# EAGLE design zero_board (EAGLE 9.6.2)
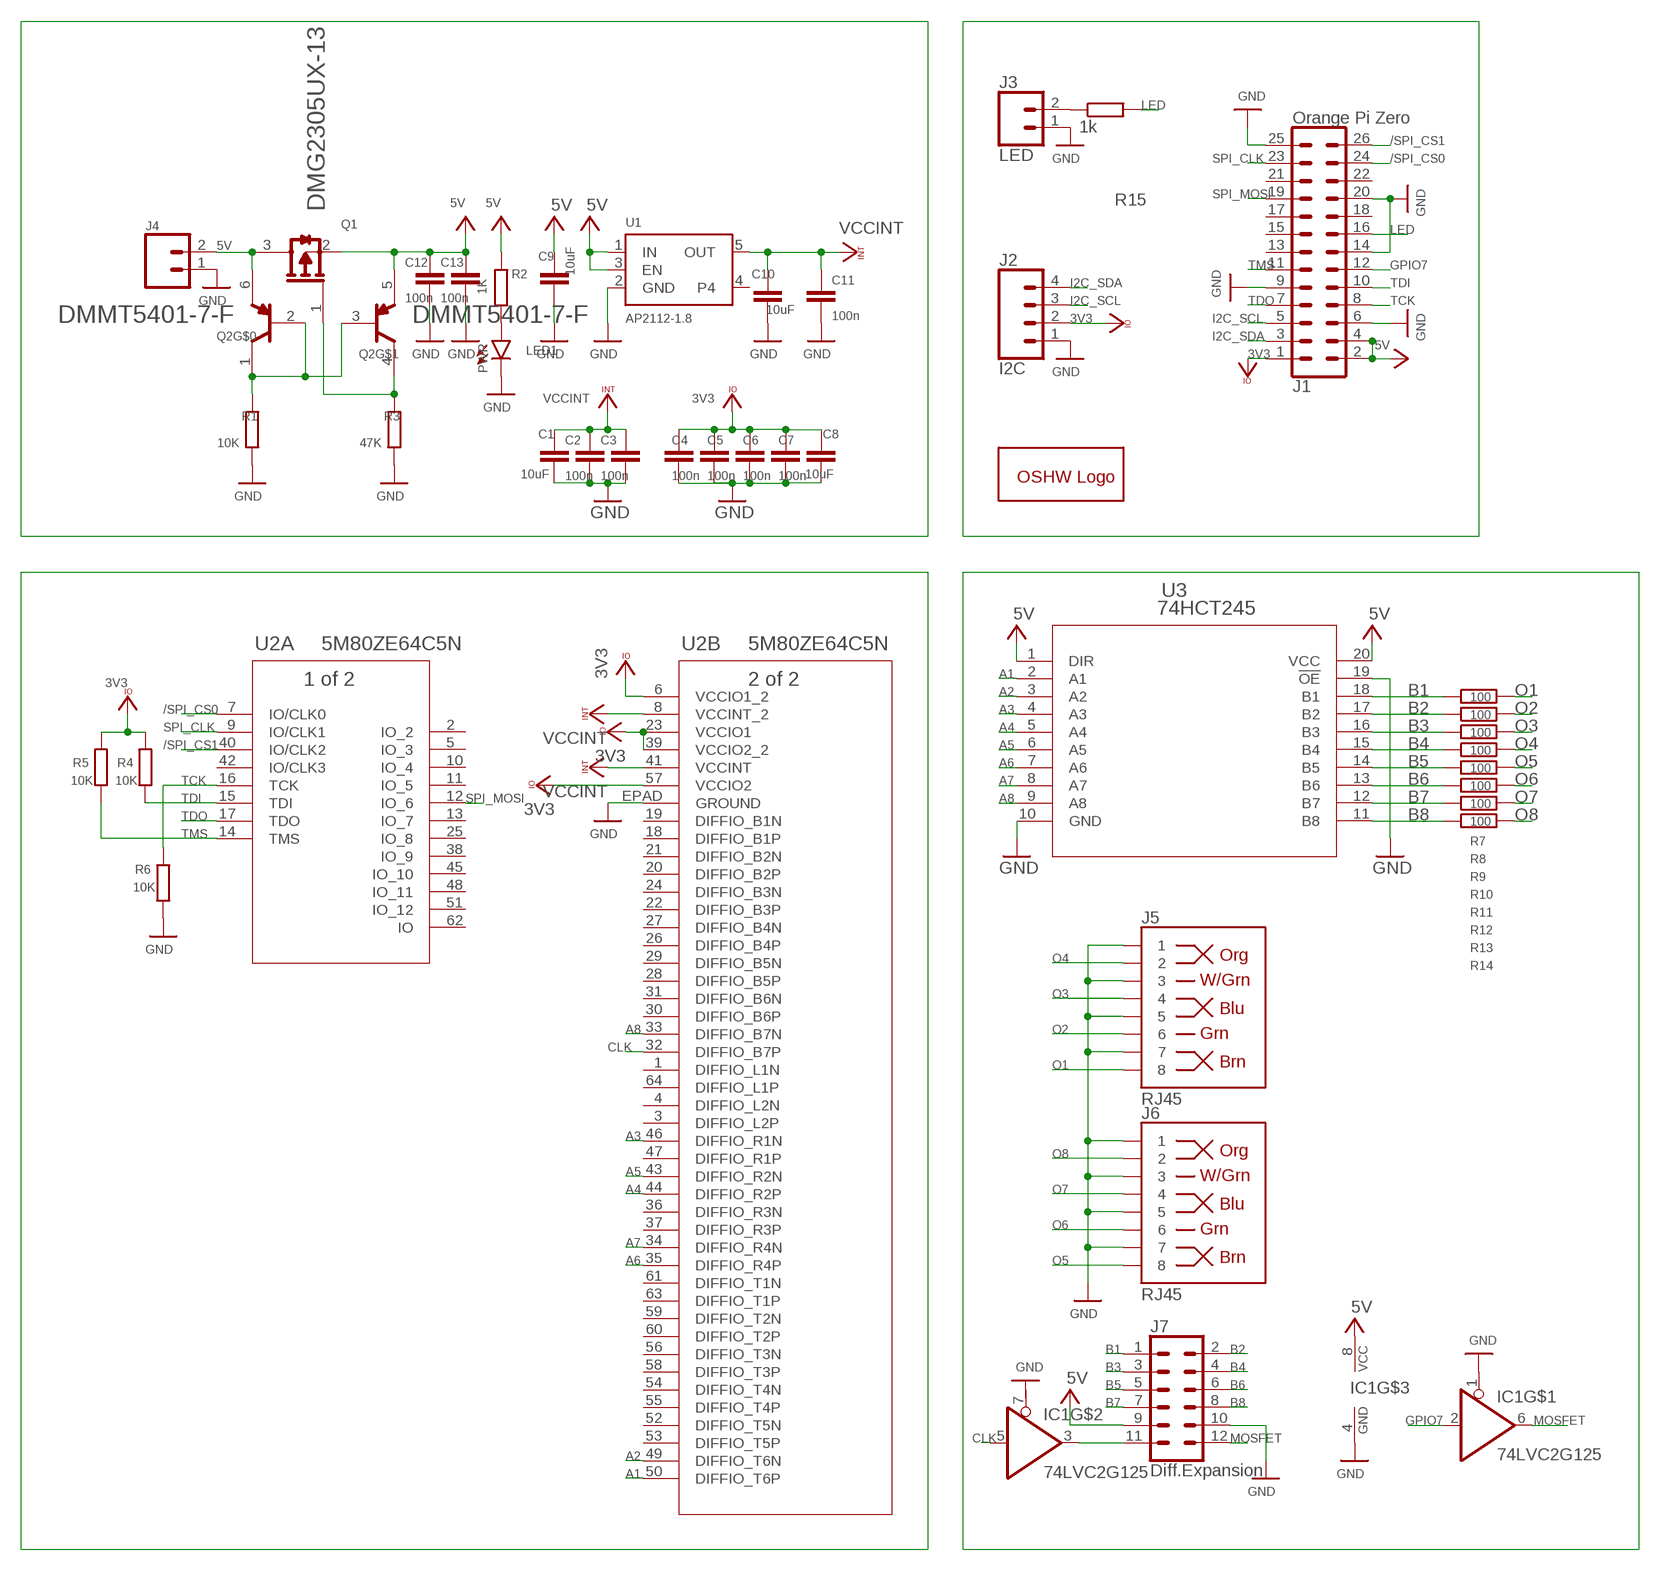
[diagram p0: schematic, sheet 1]

## Parts
C1  10uF  C-EUC0805  [C0805]
C2  100n  C-EUC0603  [C0603]
C3  100n  C-EUC0603  [C0603]
C4  100n  C-EUC0603  [C0603]
C5  100n  C-EUC0603  [C0603]
C6  100n  C-EUC0603  [C0603]
C7  100n  C-EUC0603  [C0603]
C8  10uF  C-EUC0805  [C0805]
C9  10uF  C-EUC0805  [C0805]
C10  10uF  C-EUC0805  [C0805]
C11  100n  C-EUC0603  [C0603]
C12  100n  C-EUC0603  [C0603]
C13  100n  C-EUC0603  [C0603]
GOLD_ORB_SM1  OSHWLOGOLOGO5MM  [OSHW_5MM]
IC1  74LVC2G125  74LVC2G125DCT  [SSOP08]
J1  Orange Pi Zero  CONN_13X22X13  [2X13]
J2  I2C  CONN_04  [1X04]
J3  LED  CONN_02  [1X02]
J4  5V  CONN_023.5MM  [SCREWTERMINAL-3.5MM-2]
J5  RJ45  RJ45-8  [RJ45-8]
J6  RJ45  RJ45-8  [RJ45-8]
J7  Diff.Expansion  CONN_06X2PTH_FEMALE  [2X6]
LED1  PWR  LEDCHIP-LED0603  [CHIP-LED0603]
Q1  DIODES_INC._DMG2305UX-13DIODES_INC._DMG2305UX-13_0_0  [DIODES_INC._DMG2305UX-13_0]
Q2  DMMT5401-7-F_0_0  DIODES_DMMT5401-7-FDIODES_DMMT5401-7-F_0_0  [DIODES_DMMT5401-7-F_0]
R1  10K  R-EU_R0402  [R0402]
R2  1K  R-EU_R0402  [R0402]
R3  47K  R-EU_R0402  [R0402]
R4  10K  R-EU_R0402  [R0402]
R5  10K  R-EU_R0402  [R0402]
R6  10K  R-EU_R0402  [R0402]
R7  100  R-EU_R0402  [R0402]
R8  100  R-EU_R0402  [R0402]
R9  100  R-EU_R0402  [R0402]
R10  100  R-EU_R0402  [R0402]
R11  100  R-EU_R0402  [R0402]
R12  100  R-EU_R0402  [R0402]
R13  100  R-EU_R0402  [R0402]
R14  100  R-EU_R0402  [R0402]
R15  1k  R-EU_R0402  [R0402]
U1  AP2112-1.8  VREG_SOT23-5  [SOT23-5]
U2  5M80ZE64C5N  5M80ZE64C5NEQFP64P_A1P2-D4P5_INT-L  [EQFP64P_A1P2-D4P5_INT-L]
U3  74HCT245  SN74HCT245PWR  [PW20]

## Nets
/SPI_CS0: J1.24 U2.7(A:IO/CLK0)
/SPI_CS1: J1.26 U2.40(A:IO/CLK2)
A1: U2.50(B:DIFFIO_T6P) U3.2(A1)
A2: U2.49(B:DIFFIO_T6N) U3.3(A2)
A3: U2.46(B:DIFFIO_R1N) U3.4(A3)
A4: U2.44(B:DIFFIO_R2P) U3.5(A4)
A5: U2.43(B:DIFFIO_R2N) U3.6(A5)
A6: U2.35(B:DIFFIO_R4P) U3.7(A6)
A7: U2.34(B:DIFFIO_R4N) U3.8(A7)
A8: U2.33(B:DIFFIO_B7N) U3.9(A8)
B1: J7.1 R7.1 U3.18(B1)
B2: J7.2 R8.1 U3.17(B2)
B3: J7.3 R9.1 U3.16(B3)
B4: J7.4 R10.1 U3.15(B4)
B5: J7.5 R11.1 U3.14(B5)
B6: J7.6 R12.1 U3.13(B6)
B7: J7.7 R13.1 U3.12(B7)
B8: J7.8 R14.1 U3.11(B8)
CLK: IC1.5(I) U2.32(B:DIFFIO_B7P)
GND: C1.2 C2.2 C3.2 C4.2 C5.2 C6.2 C7.2 C8.2 C9.2 C10.2 C11.2 C12.2 C13.2 IC1.1(OE) IC1.4(GND) J1.6 J1.9 J1.14 J1.20 J1.25 J2.1 J3.1 J4.1 J5.1 J5.3 J5.5 J5.7 J6.1 J6.3 J6.5 J6.7 J7.10 LED1.C R1.1 R3.1 R6.1 U1.2(GND) U2.EPAD(B:GROUND) U3.10(GND) U3.19(!OE)
GPIO7: IC1.2(I) J1.12
I2C_SCL: J1.5 J2.3
I2C_SDA: J1.3 J2.4
LED: J1.16 R15.2
MOSFET: IC1.6(O) J7.12
N$1: Q2.1(C1) Q2.2(B1) Q2.3(B2) R1.2
N$2: J4.2 Q1.3(D) Q2.6(E1)
N$3: Q1.1(G) Q2.4(C2) R3.2
N$4: J3.2 R15.1
N$9: IC1.3(O) J7.11
N$14: LED1.A R2.2
O1: J5.8 R7.2
O2: J5.6 R8.2
O3: J5.4 R9.2
O4: J5.2 R10.2
O5: J6.8 R11.2
O6: J6.6 R12.2
O7: J6.4 R13.2
O8: J6.2 R14.2
SPI_CLK: J1.23 U2.9(A:IO/CLK1)
SPI_MOSI: J1.19 U2.12(A:IO_6)
TCK: J1.8 R6.2 U2.16(A:TCK)
TDI: J1.10 R4.1 U2.15(A:TDI)
TDO: J1.7 U2.17(A:TDO)
TMS: J1.11 R5.1 U2.14(A:TMS)
VCC: C9.1 C12.1 C13.1 IC1.8(VCC) J1.2 J1.4 J7.9 Q1.2(S) Q2.5(E2) R2.1 U1.1(IN) U1.3(EN) U3.1(DIR) U3.20(VCC) ; supply symbol labelled 5V
VCCINT: C1.1 C2.1 C3.1 C10.1 C11.1 U1.5(OUT) U2.8(B:VCCINT_2) U2.41(B:VCCINT)
VCCIO: C4.1 C5.1 C6.1 C7.1 C8.1 J1.1 J2.2 R4.2 R5.2 U2.6(B:VCCIO1_2) U2.23(B:VCCIO1) U2.39(B:VCCIO2_2) U2.57(B:VCCIO2) ; supply symbol labelled 3V3
Unconnected: IC1.7(OE) J1.13 J1.15 J1.17 J1.18 J1.21 J1.22 U1.4 U2.1(B:DIFFIO_L1N) U2.2(A:IO_2) U2.3(B:DIFFIO_L2P) U2.4(B:DIFFIO_L2N) U2.5(A:IO_3) U2.10(A:IO_4) U2.11(A:IO_5) U2.13(A:IO_7) U2.18(B:DIFFIO_B1P) U2.19(B:DIFFIO_B1N) U2.20(B:DIFFIO_B2P) U2.21(B:DIFFIO_B2N) U2.22(B:DIFFIO_B3P) U2.24(B:DIFFIO_B3N) U2.25(A:IO_8) U2.26(B:DIFFIO_B4P) U2.27(B:DIFFIO_B4N) U2.28(B:DIFFIO_B5P) U2.29(B:DIFFIO_B5N) U2.30(B:DIFFIO_B6P) U2.31(B:DIFFIO_B6N) U2.36(B:DIFFIO_R3N) U2.37(B:DIFFIO_R3P) U2.38(A:IO_9) U2.42(A:IO/CLK3) U2.45(A:IO_10) U2.47(B:DIFFIO_R1P) U2.48(A:IO_11) U2.51(A:IO_12) U2.52(B:DIFFIO_T5N) U2.53(B:DIFFIO_T5P) U2.54(B:DIFFIO_T4N) U2.55(B:DIFFIO_T4P) U2.56(B:DIFFIO_T3N) U2.58(B:DIFFIO_T3P) U2.59(B:DIFFIO_T2N) U2.60(B:DIFFIO_T2P) U2.61(B:DIFFIO_T1N) U2.62(A:IO) U2.63(B:DIFFIO_T1P) U2.64(B:DIFFIO_L1P)

## Library data of the parts
C1-C13 = rcl:C-EU: CAPACITOR, European symbol; SPICEPREFIX: C
GOLD_ORB_SM1 = oshw:OSHWLOGO: The OSHW logo for PCB layout
IC1 = 74xx-little-de:74*2G125: Dual line drivers with 3-state outputs.
J1 = SparkFun-Connectors:CONN_13X2: Multi connection point. Often used as Generic Header-pin footprint for 0.1 inch spaced/style header connections On any of the 0.1 inch spaced packages, you can populate with these: Break Away Headers - Straight <https://www.sparkfun.com/products/116> (PRT-00116) Break Away Male Headers - Right Angle <https://www.sparkfun.com/products/553> (PRT-00553) Female Headers <https://www.sparkfun.com/products/115> (PRT-00115) Break Away Headers - Machine Pin <https://www.sparkfun.com/products/117> (PRT-00117) Break Away Female Headers - Swiss Machine Pin <https://www.sparkfun.com/products/743> (PRT-00743)
J2 = SparkFun-Connectors:CONN_04: Multi connection point. Often used as Generic Header-pin footprint for 0.1 inch spaced/style header connections On any of the 0.1 inch spaced packages, you can populate with these: Break Away Headers - Straight <https://www.sparkfun.com/products/116> (PRT-00116) Break Away Male Headers - Right Angle <https://www.sparkfun.com/products/553> (PRT-00553) Female Headers <https://www.sparkfun.com/products/115> (PRT-00115) Break Away Headers - Machine Pin <https://www.sparkfun.com/products/117> (PRT-00117) Break Away Female Headers - Swiss Machine Pin <https://www.sparkfun.com/products/743> (PRT-00743) For SCREWTERMINALS and SPRING TERMINALS visit here: Screw Terimnals on SparkFun.com <https://www.sparkfun.com/search/results?term=Screw+Terminals> (5mm/3.5mm/2.54mm spacing) This device is also useful as a general connection point to wire up your design to another part of your project. Our various solder wires solder well into these plated through hole pads. Hook-Up Wire - Assortment (Stranded, 22 AWG) <https://www.sparkfun.com/products/11375> (PRT-11375) Hook-Up Wire - Assortment (Solid Core, 22 AWG) <https://www.sparkfun.com/products/11367> (PRT-11367) View the entire wire category on our website here <https://www.sparkfun.com/categories/141> Special notes: Molex polarized connector foot print use with SKU : PRT-08231 with associated crimp pins and housings. 1MM SMD Version SKU: PRT-10208; PROD_ID: CONN-09696
J3 = SparkFun-Connectors:CONN_02: Multi connection point. Often used as Generic Header-pin footprint for 0.1 inch spaced/style header connections On any of the 0.1 inch spaced packages, you can populate with these: Break Away Headers - Straight <https://www.sparkfun.com/products/116> (PRT-00116) Break Away Male Headers - Right Angle <https://www.sparkfun.com/products/553> (PRT-00553) Female Headers <https://www.sparkfun.com/products/115> (PRT-00115) Break Away Headers - Machine Pin <https://www.sparkfun.com/products/117> (PRT-00117) Break Away Female Headers - Swiss Machine Pin <https://www.sparkfun.com/products/743> (PRT-00743) For SCREWTERMINALS and SPRING TERMINALS visit here: Screw Terimnals on SparkFun.com <https://www.sparkfun.com/search/results?term=Screw+Terminals> (5mm/3.5mm/2.54mm spacing) This device is also useful as a general connection point to wire up your design to another part of your project. Our various solder wires solder well into these plated through hole pads. Hook-Up Wire - Assortment (Stranded, 22 AWG) <https://www.sparkfun.com/products/11375> (PRT-11375) Hook-Up Wire - Assortment (Solid Core, 22 AWG) <https://www.sparkfun.com/products/11367> (PRT-11367) View the entire wire category on our website here <https://www.sparkfun.com/categories/141> Special notes: Molex polarized connector foot print use with: PRT-08233 with associated crimp pins and housings. 2.54_SCREWTERM for use with PRT-10571. 3.5mm Screw Terminal footprints for PRT-08084 5mm Screw Terminal footprints for use with PRT-08432
J4 = SparkFun-Connectors:CONN_02: Multi connection point. Often used as Generic Header-pin footprint for 0.1 inch spaced/style header connections On any of the 0.1 inch spaced packages, you can populate with these: Break Away Headers - Straight <https://www.sparkfun.com/products/116> (PRT-00116) Break Away Male Headers - Right Angle <https://www.sparkfun.com/products/553> (PRT-00553) Female Headers <https://www.sparkfun.com/products/115> (PRT-00115) Break Away Headers - Machine Pin <https://www.sparkfun.com/products/117> (PRT-00117) Break Away Female Headers - Swiss Machine Pin <https://www.sparkfun.com/products/743> (PRT-00743) For SCREWTERMINALS and SPRING TERMINALS visit here: Screw Terimnals on SparkFun.com <https://www.sparkfun.com/search/results?term=Screw+Terminals> (5mm/3.5mm/2.54mm spacing) This device is also useful as a general connection point to wire up your design to another part of your project. Our various solder wires solder well into these plated through hole pads. Hook-Up Wire - Assortment (Stranded, 22 AWG) <https://www.sparkfun.com/products/11375> (PRT-11375) Hook-Up Wire - Assortment (Solid Core, 22 AWG) <https://www.sparkfun.com/products/11367> (PRT-11367) View the entire wire category on our website here <https://www.sparkfun.com/categories/141> Special notes: Molex polarized connector foot print use with: PRT-08233 with associated crimp pins and housings. 2.54_SCREWTERM for use with PRT-10571. 3.5mm Screw Terminal footprints for PRT-08084 5mm Screw Terminal footprints for use with PRT-08432; PROD_ID: CONN-08399
J5 J6 = SparkFun-Connectors:RJ45-8: RJ45 Jack - 8 pin Simple RJ45, 8-pin connection. Commonly used for Cat5, Cat5e, and Cat6 Ethernet cables. Here is the connector we sell at SparkFun: RJ45 8-Pin Connector <https://www.sparkfun.com/products/643> (PRT-00643) Datasheet <https://cdn.sparkfun.com/datasheets/Prototyping/04908.pdf> It is used on this SparkFun product: SparkFun RJ45 Breakout <https://www.sparkfun.com/products/716> (BOB-00716) Note, you may also be interested in the "MAGJACK" version of this. It is basically a RJ45 connector, but also has some status LEDs built into the connector housing. You can check that out in this library at the device named "MAGJACK.dev" and see these products online: RJ45 Ethernet MagJack-Compatible <https://www.sparkfun.com/products/8534> (PRT-08534) SparkFun RJ45 MagJack Breakout <https://www.sparkfun.com/products/13021> (BOB-13021); PROD_ID: CONN-08506; SF_ID: PRT-00643
J7 = SparkFun-Connectors:CONN_06X2: Multi connection point. Often used as Generic Header-pin footprint for 0.1 inch spaced/style header connections On any of the 0.1 inch spaced packages, you can populate with these: Break Away Headers - Straight <https://www.sparkfun.com/products/116> (PRT-00116) Break Away Male Headers - Right Angle <https://www.sparkfun.com/products/553> (PRT-00553) Female Headers <https://www.sparkfun.com/products/115> (PRT-00115) Break Away Headers - Machine Pin <https://www.sparkfun.com/products/117> (PRT-00117) Break Away Female Headers - Swiss Machine Pin <https://www.sparkfun.com/products/743> (PRT-00743); PROD_ID: CONN-12423; VALUE: 2X6 FEMALE
LED1 = led:LED: LED OSRAM: - CHIPLED LG R971, LG N971, LY N971, LG Q971, LY Q971, LO R971, LY R971 LH N974, LH R974 LS Q976, LO Q976, LY Q976 LO Q996 - Hyper CHIPLED LW Q18S LB Q993, LB Q99A, LB R99A - SideLED LS A670, LO A670, LY A670, LG A670, LP A670 LB A673, LV A673, LT A673, LW A673 LH A674 LY A675 LS A676, LA A676, LO A676, LY A676, LW A676 LS A679, LY A679, LG A679 - Hyper Micro SIDELED® LS Y876, LA Y876, LO Y876, LY Y876 LT Y87S - SmartLED LW L88C, LW L88S LB L89C, LB L89S, LG L890 LS L89K, LO L89K, LY L89K LS L896, LA L896, LO L896, LY L896 - TOPLED LS T670, LO T670, LY T670, LG T670, LP T670 LSG T670, LSP T670, LSY T670, LOP T670, LYG T670 LG T671, LOG T671, LSG T671 LB T673, LV T673, LT T673, LW T673 LH T674 LS T676, LA T676, LO T676, LY T676, LB T676, LH T676, LSB T676, LW T676 LB T67C, LV T67C, LT T67C, LS T67K, LO T67K, LY T67K, LW E67C LS E67B, LA E67B, LO E67B, LY E67B, LB E67C, LV E67C, LT E67C LW T67C LS T679, LY T679, LG T679 LS T770, LO T770, LY T770, LG T770, LP T770 LB T773, LV T773, LT T773, LW T773 LH T774 LS E675, LA E675, LY E675, LS T675 LS T776, LA T776, LO T776, LY T776, LB T776 LHGB T686 LT T68C, LB T68C - Hyper Mini TOPLED® LB M676 - Mini TOPLED Santana® LG M470 LS M47K, LO M47K, LY M47K Source: http://www.osram.convergy.de LUXEON: - LUMILED® LXK2-PW12-R00, LXK2-PW12-S00, LXK2-PW14-U00, LXK2-PW14-V00 LXK2-PM12-R00, LXK2-PM12-S00, LXK2-PM14-U00 LXK2-PE12-Q00, LXK2-PE12-R00, LXK2-PE12-S00, LXK2-PE14-T00, LXK2-PE14-U00 LXK2-PB12-K00, LXK2-PB12-L00, LXK2-PB12-M00, LXK2-PB14-N00, LXK2-PB14-P00, LXK2-PB14-Q00 LXK2-PR12-L00, LXK2-PR12-M00, LXK2-PR14-Q00, LXK2-PR14-R00 LXK2-PD12-Q00, LXK2-PD12-R00, LXK2-PD12-S00 LXK2-PH12-R00, LXK2-PH12-S00 LXK2-PL12-P00, LXK2-PL12-Q00, LXK2-PL12-R00 Source: www.luxeon.com KINGBRIGHT: KA-3528ASYC Source: www.kingbright.com
Q1 = Diodes Inc. - DMG2305UX-13:DIODES_INC._DMG2305UX-13: P-Channel 20V 4.2A (Ta) 1.4W (Ta) Surface Mount SOT-23; AUTOMOTIVE: No; CENTROID_NOT_SPECIFIED: No; CONTINUOUS_DRAIN_CURRENT: -4.2A; DATASHEET: https://www.diodes.com/assets/Datasheets/DMG2305UX.pdf; DEPLETION_MODE: False; DEVICE_CLASS_L1: Discrete Semiconductors; DEVICE_CLASS_L2: Transistors; DEVICE_CLASS_L3: MOSFETs; DIGIKEY_DESCRIPTION: TRANS MOSFET P-CH 20V 4.2A SOT23; DIGIKEY_PART_NUMBER: DMG2305UX-13DICT-ND; DRAIN_TO_SOURCE_BREAKDOWN_VOLTAGE: -20V; DRAIN_TO_SOURCE_RESISTANCE: 40mΩ; DRAIN_TO_SOURCE_VOLTAGE: -20V; FOOTPRINT_PARAMETERS_1: {"fp_type":"SOT23","params":{"N":{"default":"3","long name":"Number of leads","type":"multichoice","short name":"N"},"A":{"nom":1024999,"long name":"Height","min":903000,"max":1100000,"short name":"A","type":"measurement"},"A1":{"nom":50000,"long name":"Package clearance","min":13000,"max":100000,"short name":"A1","type":"measurement"},"A2":{"nom":975000,"long name":"Package height","min":890000,"max":1000000,"short name":"A2","type":"measurement"},"D":{"nom":2900000,"long name":"Package length","min":2800000,"max":3000000,"short name":"D","type":"measurement"},"E":{"nom":2400000,"long name":"Width /w leads","min":2300000,"max":2500000,"short name":"E","type":"measurement"},"E1":{"nom":1300000,"long name":"Package width","min":1200000,"max":1400000,"short name":"E1","type":"measurement"},"B":{"nom":400000,"long name":"Lead width","min":370000,"max":510000,"short name":"B","type":"measurement"},"C":{"nom":110000,"long name":"Lead thickness","min":85000,"max":150000,"short name":"C","type":"measurement"},"L":{"nom":400000,"long name":"Lead foot length","min":250000,"max":550000,"short name":"L","type":"measurement"},"e":{"nom":915000,"long name":"Lead pitch","min":null,"max":null,"short name":"e","type":"measurement"},"PHI":{"nom":false,"long name":"Lead angle","min":0,"max":8000000,"short name":"PHI","type":"measurement"},"offset x":{"nom":0,"long name":"X Center offset","min":null,"max":null,"short name":"offset x","type":"measurement"},"offset y":{"nom":0,"long name":"Y Center offset","min":null,"max":null,"short name":"offset y","type":"measurement"},"LS":{"default":"Rounded rectangle","long name":"Land shape","type":"multichoice","short name":"LS"},"LS1":{"default":"Rectangle","long name":"Land shape (Pin 1)","type":"multichoice","short name":"LS1"},"solder toe":{"nom":550000,"long name":"Solder fillet (toe)","min":null,"max":null,"short name":"solder toe","type":"fixedmeasurement"},"solder heel":{"nom":450000,"long name":"Solder fillet (heel)","min":null,"max":null,"short name":"solder heel","type":"fixedmeasurement"},"solder side":{"nom":50000,"long name":"Solder fillet (side)","min":null,"max":null,"short name":"solder side","type":"fixedmeasurement"},"courtyard":{"nom":500000,"long name":"Courtyard","min":null,"max":null,"short name":"courtyard","type":"fixedmeasurement"},"SF":{"default":"A","long name":"Packing level","type":"multichoiceparent","short name":"SF","help":"http://support.upverter.com/customer/portal/articles/978783-what-is-a-footprint-packing-level","children":["solder toe","solder heel","solder side","courtyard"]}}}; FOOTPRINT_PARAMETERS_2: {"fp_type":"SOT23","params":{"N":{"default":"3","long name":"Number of leads","type":"multichoice","short name":"N"},"A":{"nom":1024999,"long name":"Height","min":903000,"max":1100000,"short name":"A","type":"measurement"},"A1":{"nom":50000,"long name":"Package clearance","min":13000,"max":100000,"short name":"A1","type":"measurement"},"A2":{"nom":975000,"long name":"Package height","min":890000,"max":1000000,"short name":"A2","type":"measurement"},"D":{"nom":2900000,"long name":"Package length","min":2800000,"max":3000000,"short name":"D","type":"measurement"},"E":{"nom":2400000,"long name":"Width /w leads","min":2300000,"max":2500000,"short name":"E","type":"measurement"},"E1":{"nom":1300000,"long name":"Package width","min":1200000,"max":1400000,"short name":"E1","type":"measurement"},"B":{"nom":400000,"long name":"Lead width","min":370000,"max":510000,"short name":"B","type":"measurement"},"C":{"nom":110000,"long name":"Lead thickness","min":85000,"max":150000,"short name":"C","type":"measurement"},"L":{"nom":400000,"long name":"Lead foot length","min":250000,"max":550000,"short name":"L","type":"measurement"},"e":{"nom":915000,"long name":"Lead pitch","min":null,"max":null,"short name":"e","type":"measurement"},"PHI":{"nom":false,"long name":"Lead angle","min":0,"max":8000000,"short name":"PHI","type":"measurement"},"offset x":{"nom":0,"long name":"X Center offset","min":null,"max":null,"short name":"offset x","type":"measurement"},"offset y":{"nom":0,"long name":"Y Center offset","min":null,"max":null,"short name":"offset y","type":"measurement"},"LS":{"default":"Rounded rectangle","long name":"Land shape","type":"multichoice","short name":"LS"},"LS1":{"default":"Rectangle","long name":"Land shape (Pin 1)","type":"multichoice","short name":"LS1"},"solder toe":{"nom":350000,"long name":"Solder fillet (toe)","min":null,"max":null,"short name":"solder toe","type":"fixedmeasurement"},"solder heel":{"nom":350000,"long name":"Solder fillet (heel)","min":null,"max":null,"short name":"solder heel","type":"fixedmeasurement"},"solder side":{"nom":30000,"long name":"Solder fillet (side)","min":null,"max":null,"short name":"solder side","type":"fixedmeasurement"},"courtyard":{"nom":250000,"long name":"Courtyard","min":null,"max":null,"short name":"courtyard","type":"fixedmeasurement"},"SF":{"default":"B","long name":"Packing level","type":"multichoiceparent","short name":"SF","help":"http://support.upverter.com/customer/portal/articles/978783-what-is-a-footprint-packing-level","children":["solder toe","solder heel","solder side","courtyard"]}}}; FOOTPRINT_PARAMETERS_3: {"fp_type":"SOT23","params":{"N":{"default":"3","long name":"Number of leads","type":"multichoice","short name":"N"},"A":{"nom":1024999,"long name":"Height","min":903000,"max":1100000,"short name":"A","type":"measurement"},"A1":{"nom":50000,"long name":"Package clearance","min":13000,"max":100000,"short name":"A1","type":"measurement"},"A2":{"nom":975000,"long name":"Package height","min":890000,"max":1000000,"short name":"A2","type":"measurement"},"D":{"nom":2900000,"long name":"Package length","min":2800000,"max":3000000,"short name":"D","type":"measurement"},"E":{"nom":2400000,"long name":"Width /w leads","min":2300000,"max":2500000,"short name":"E","type":"measurement"},"E1":{"nom":1300000,"long name":"Package width","min":1200000,"max":1400000,"short name":"E1","type":"measurement"},"B":{"nom":400000,"long name":"Lead width","min":370000,"max":510000,"short name":"B","type":"measurement"},"C":{"nom":110000,"long name":"Lead thickness","min":85000,"max":150000,"short name":"C","type":"measurement"},"L":{"nom":400000,"long name":"Lead foot length","min":250000,"max":550000,"short name":"L","type":"measurement"},"e":{"nom":915000,"long name":"Lead pitch","min":null,"max":null,"short name":"e","type":"measurement"},"PHI":{"nom":false,"long name":"Lead angle","min":0,"max":8000000,"short name":"PHI","type":"measurement"},"offset x":{"nom":0,"long name":"X Center offset","min":null,"max":null,"short name":"offset x","type":"measurement"},"offset y":{"nom":0,"long name":"Y Center offset","min":null,"max":null,"short name":"offset y","type":"measurement"},"LS":{"default":"Rounded rectangle","long name":"Land shape","type":"multichoice","short name":"LS"},"LS1":{"default":"Rectangle","long name":"Land shape (Pin 1)","type":"multichoice","short name":"LS1"},"solder toe":{"nom":150000,"long name":"Solder fillet (toe)","min":null,"max":null,"short name":"solder toe","type":"fixedmeasurement"},"solder heel":{"nom":250000,"long name":"Solder fillet (heel)","min":null,"max":null,"short name":"solder heel","type":"fixedmeasurement"},"solder side":{"nom":10000,"long name":"Solder fillet (side)","min":null,"max":null,"short name":"solder side","type":"fixedmeasurement"},"courtyard":{"nom":100000,"long name":"Courtyard","min":null,"max":null,"short name":"courtyard","type":"fixedmeasurement"},"SF":{"default":"C","long name":"Packing level","type":"multichoiceparent","short name":"SF","help":"http://support.upverter.com/customer/portal/articles/978783-what-is-a-footprint-packing-level","children":["solder toe","solder heel","solder side","courtyard"]}}}; FOOTPRINT_URL: https://www.diodes.com/assets/Package-Files/SOT23.pdf; FOOTPRINT_VARIANT_NAME_0: Recommended_Land_Pattern; FOOTPRINT_VARIANT_NAME_1: IPC_A; FOOTPRINT_VARIANT_NAME_2: IPC_B; FOOTPRINT_VARIANT_NAME_3: IPC_C; GATE_CHARGE_AT_VGS: 10.2nC @ -4.5V; GATE_TO_SOURCE_VOLTAGE: 8V; HEIGHT: 1.1mm; INPUT_CAPACITACE_AT_VDS: 808pF @ -15V; IPC_LAND_PATTERN_NAME: SOT92P240X102-3; LEAD_FREE: Yes; MAX_JUNCTION_TEMP: +150°C; MF: Diodes Inc.; MFG_PACKAGE_IDENT: SOT23; MFG_PACKAGE_IDENT_DATE: 01/2017; MFG_PACKAGE_IDENT_REV: 0; MOUSER_DESCRIPTION: MOSFET P-Ch ENH FET -20V 52mOhm -5.0V; MOUSER_PART_NUMBER: 621-DMG2305UX-13; MPN: DMG2305UX-13; NUMBER_OF_CHANNELS: 1; NUMBER_OF_P_CHANNELS: 1; PACKAGE: SOT23; POWER_DISSIPATION: 1.4W; PREFIX: Q; PULSE_DRAIN_CURRENT: -15A; ROHS: Yes; RTHJA_MAX: 90°C/W; STANDOFF_HEIGHT: 0.013mm; TEMPERATURE_RANGE_HIGH: +150°C; TEMPERATURE_RANGE_LOW: -55°C; THRESHOLD_VGS_MAX: -0.9V; THRESHOLD_VGS_MIN: -0.5V; TURN_OFF_DELAY_TIME: 79.3ns; TURN_ON_DELAY_TIME: 10.8ns; VERIFICATION_VERSION: 0.0.0.3
Q2 = Diodes - DMMT5401-7-F:DIODES_DMMT5401-7-F: Bipolar (BJT) Transistor Array 2 PNP (Dual) Matched Pair 150V 200mA 300MHz 300mW Surface Mount SOT-26; AUTOMOTIVE: Yes; AUTOMOTIVE_GRADE: Grade 0; CENTROID_NOT_SPECIFIED: No; CIIVA_IDS: 854262; COLLECTOR_BASE_VOLTAGE: -160V; COLLECTOR_EMITTER_BREAKDOWN_VOLTAGE: -150V; COLLECTOR_EMITTER_SATURATION_VOLTAGE: -0.5V; COLLECTOR_EMITTER_VOLTAGE: -150V; DATASHEET: https://www.diodes.com/assets/Datasheets/ds30437.pdf; DEVICE_CLASS_L1: Discrete Semiconductors; DEVICE_CLASS_L2: Transistors; DEVICE_CLASS_L3: BJTs; DIGIKEY_DESCRIPTION: TRANS 2PNP 150V 0.2A SOT26; DIGIKEY_PART_NUMBER: DMMT5401-FDICT-ND; EMITTER_BASE_VOLTAGE: -5V; FOOTPRINT_PARAMETERS_1: {"fp_type":"SOT23","params":{"N":{"default":"6","long name":"Number of leads","type":"multichoice","short name":"N"},"A":{"nom":1150000,"long name":"Height","min":1012999,"max":1400000,"short name":"A","type":"measurement"},"A1":{"nom":50000,"long name":"Package clearance","min":13000,"max":100000,"short name":"A1","type":"measurement"},"A2":{"nom":1100000,"long name":"Package height","min":1000000,"max":1300000,"short name":"A2","type":"measurement"},"D":{"nom":3000000,"long name":"Package length","min":2900000,"max":3100000,"short name":"D","type":"measurement"},"E":{"nom":2800000,"long name":"Width /w leads","min":2700000,"max":3000000,"short name":"E","type":"measurement"},"E1":{"nom":1600000,"long name":"Package width","min":1500000,"max":1700000,"short name":"E1","type":"measurement"},"B":{"nom":380000,"long name":"Lead width","min":350000,"max":500000,"short name":"B","type":"measurement"},"C":{"nom":150000,"long name":"Lead thickness","min":100000,"max":200000,"short name":"C","type":"measurement"},"L":{"nom":400000,"long name":"Lead foot length","min":350000,"max":550000,"short name":"L","type":"measurement"},"e":{"nom":950000,"long name":"Lead pitch","min":null,"max":null,"short name":"e","type":"measurement"},"PHI":{"nom":false,"long name":"Lead angle","min":0,"max":8000000,"short name":"PHI","type":"measurement"},"offset x":{"nom":0,"long name":"X Center offset","min":null,"max":null,"short name":"offset x","type":"measurement"},"offset y":{"nom":0,"long name":"Y Center offset","min":null,"max":null,"short name":"offset y","type":"measurement"},"LS":{"default":"Rounded rectangle","long name":"Land shape","type":"multichoice","short name":"LS"},"LS1":{"default":"Rectangle","long name":"Land shape (Pin 1)","type":"multichoice","short name":"LS1"},"solder toe":{"nom":550000,"long name":"Solder fillet (toe)","min":null,"max":null,"short name":"solder toe","type":"fixedmeasurement"},"solder heel":{"nom":450000,"long name":"Solder fillet (heel)","min":null,"max":null,"short name":"solder heel","type":"fixedmeasurement"},"solder side":{"nom":50000,"long name":"Solder fillet (side)","min":null,"max":null,"short name":"solder side","type":"fixedmeasurement"},"courtyard":{"nom":500000,"long name":"Courtyard","min":null,"max":null,"short name":"courtyard","type":"fixedmeasurement"},"SF":{"default":"A","long name":"Packing level","type":"multichoiceparent","short name":"SF","help":"http://support.upverter.com/customer/portal/articles/978783-what-is-a-footprint-packing-level","children":["solder toe","solder heel","solder side","courtyard"]}}}; FOOTPRINT_PARAMETERS_2: {"fp_type":"SOT23","params":{"N":{"default":"6","long name":"Number of leads","type":"multichoice","short name":"N"},"A":{"nom":1150000,"long name":"Height","min":1012999,"max":1400000,"short name":"A","type":"measurement"},"A1":{"nom":50000,"long name":"Package clearance","min":13000,"max":100000,"short name":"A1","type":"measurement"},"A2":{"nom":1100000,"long name":"Package height","min":1000000,"max":1300000,"short name":"A2","type":"measurement"},"D":{"nom":3000000,"long name":"Package length","min":2900000,"max":3100000,"short name":"D","type":"measurement"},"E":{"nom":2800000,"long name":"Width /w leads","min":2700000,"max":3000000,"short name":"E","type":"measurement"},"E1":{"nom":1600000,"long name":"Package width","min":1500000,"max":1700000,"short name":"E1","type":"measurement"},"B":{"nom":380000,"long name":"Lead width","min":350000,"max":500000,"short name":"B","type":"measurement"},"C":{"nom":150000,"long name":"Lead thickness","min":100000,"max":200000,"short name":"C","type":"measurement"},"L":{"nom":400000,"long name":"Lead foot length","min":350000,"max":550000,"short name":"L","type":"measurement"},"e":{"nom":950000,"long name":"Lead pitch","min":null,"max":null,"short name":"e","type":"measurement"},"PHI":{"nom":false,"long name":"Lead angle","min":0,"max":8000000,"short name":"PHI","type":"measurement"},"offset x":{"nom":0,"long name":"X Center offset","min":null,"max":null,"short name":"offset x","type":"measurement"},"offset y":{"nom":0,"long name":"Y Center offset","min":null,"max":null,"short name":"offset y","type":"measurement"},"LS":{"default":"Rounded rectangle","long name":"Land shape","type":"multichoice","short name":"LS"},"LS1":{"default":"Rectangle","long name":"Land shape (Pin 1)","type":"multichoice","short name":"LS1"},"solder toe":{"nom":350000,"long name":"Solder fillet (toe)","min":null,"max":null,"short name":"solder toe","type":"fixedmeasurement"},"solder heel":{"nom":350000,"long name":"Solder fillet (heel)","min":null,"max":null,"short name":"solder heel","type":"fixedmeasurement"},"solder side":{"nom":30000,"long name":"Solder fillet (side)","min":null,"max":null,"short name":"solder side","type":"fixedmeasurement"},"courtyard":{"nom":250000,"long name":"Courtyard","min":null,"max":null,"short name":"courtyard","type":"fixedmeasurement"},"SF":{"default":"B","long name":"Packing level","type":"multichoiceparent","short name":"SF","help":"http://support.upverter.com/customer/portal/articles/978783-what-is-a-footprint-packing-level","children":["solder toe","solder heel","solder side","courtyard"]}}}; FOOTPRINT_PARAMETERS_3: {"fp_type":"SOT23","params":{"N":{"default":"6","long name":"Number of leads","type":"multichoice","short name":"N"},"A":{"nom":1150000,"long name":"Height","min":1012999,"max":1400000,"short name":"A","type":"measurement"},"A1":{"nom":50000,"long name":"Package clearance","min":13000,"max":100000,"short name":"A1","type":"measurement"},"A2":{"nom":1100000,"long name":"Package height","min":1000000,"max":1300000,"short name":"A2","type":"measurement"},"D":{"nom":3000000,"long name":"Package length","min":2900000,"max":3100000,"short name":"D","type":"measurement"},"E":{"nom":2800000,"long name":"Width /w leads","min":2700000,"max":3000000,"short name":"E","type":"measurement"},"E1":{"nom":1600000,"long name":"Package width","min":1500000,"max":1700000,"short name":"E1","type":"measurement"},"B":{"nom":380000,"long name":"Lead width","min":350000,"max":500000,"short name":"B","type":"measurement"},"C":{"nom":150000,"long name":"Lead thickness","min":100000,"max":200000,"short name":"C","type":"measurement"},"L":{"nom":400000,"long name":"Lead foot length","min":350000,"max":550000,"short name":"L","type":"measurement"},"e":{"nom":950000,"long name":"Lead pitch","min":null,"max":null,"short name":"e","type":"measurement"},"PHI":{"nom":false,"long name":"Lead angle","min":0,"max":8000000,"short name":"PHI","type":"measurement"},"offset x":{"nom":0,"long name":"X Center offset","min":null,"max":null,"short name":"offset x","type":"measurement"},"offset y":{"nom":0,"long name":"Y Center offset","min":null,"max":null,"short name":"offset y","type":"measurement"},"LS":{"default":"Rounded rectangle","long name":"Land shape","type":"multichoice","short name":"LS"},"LS1":{"default":"Rectangle","long name":"Land shape (Pin 1)","type":"multichoice","short name":"LS1"},"solder toe":{"nom":150000,"long name":"Solder fillet (toe)","min":null,"max":null,"short name":"solder toe","type":"fixedmeasurement"},"solder heel":{"nom":250000,"long name":"Solder fillet (heel)","min":null,"max":null,"short name":"solder heel","type":"fixedmeasurement"},"solder side":{"nom":10000,"long name":"Solder fillet (side)","min":null,"max":null,"short name":"solder side","type":"fixedmeasurement"},"courtyard":{"nom":100000,"long name":"Courtyard","min":null,"max":null,"short name":"courtyard","type":"fixedmeasurement"},"SF":{"default":"C","long name":"Packing level","type":"multichoiceparent","short name":"SF","help":"http://support.upverter.com/customer/portal/articles/978783-what-is-a-footprint-packing-level","children":["solder toe","solder heel","solder side","courtyard"]}}}; FOOTPRINT_URL: https://www.diodes.com/assets/Package-Files/SOT26-SC74R.pdf; FOOTPRINT_VARIANT_NAME_0: Recommended_Land_Pattern; FOOTPRINT_VARIANT_NAME_1: IPC_A; FOOTPRINT_VARIANT_NAME_2: IPC_B; FOOTPRINT_VARIANT_NAME_3: IPC_C; GAIN_BANDWIDTH_PRODUCT: 100MHz; HEIGHT: 1.4mm; HFE_MAX: 240; HFE_MIN: 60; HFE_SS_MAX: 260; HFE_SS_MIN: 40; HFE_SS_TESTIC: -1mA; HFE_SS_TESTVCE: -10V; HFE_TESTIC: -10mA; HFE_TESTVCE: -5V; IMPORTED_FROM: vault; IMPORT_TS: 1521857859; LEAD_FREE: Yes; MAX_COLLECTOR_CURRENT: -200mA; MAX_JUNCTION_TEMP: +150°C; MF: Diodes; MFG_PACKAGE_IDENT: SOT26 (SC74R); MFG_PACKAGE_IDENT_COMPONENT_ID: 5f0f242ef940d63b; MFG_PACKAGE_IDENT_DATE: 03/2017; MFG_PACKAGE_IDENT_REV: 0; MOUSER_DESCRIPTION: Bipolar Transistors - BJT MATCHED PNP SM SIGNAL TRANS; MOUSER_PART_NUMBER: 621-DMMT5401-7-F; MPN: DMMT5401-7-F; NUMBER_OF_ELEMENTS: 2; NUMBER_OF_PNP: 2; PACKAGE: SOT-26-6; POWER_DISSIPATION: 300mW; PREFIX: Q; RELEASE_DATE: 1475030218; RESISTANCE: 56.2 kohm; ROHS: Yes; RTHJA_MAX: 417°C/W; STANDOFF_HEIGHT: 0.013mm; TEMPERATURE_RANGE_HIGH: +150°C; TEMPERATURE_RANGE_LOW: -55°C; VAULT_GUID: AAD9F767-3884-4A64-86E0-FF641185CA98; VERIFICATION_VERSION: 0.0.0.3
R1 R3-R15 = rcl:R-EU_: RESISTOR, European symbol; SPICEPREFIX: R
R2 = resistor:R-EU_: RESISTOR, European symbol
U1 = microbuilder:VREG_SOT23-5: SOT23-5 Fixed Voltage Regulators Part Current Out V Out V In V Dropout θJA (°C/W) TJ (°C) Digikey Part No. ADP121 150mA 3.3V 3.4-5.5V 0.09V @ 150mA -- -- ADP121-AUJZ33R7CT-ND ADP121 150mA 3.0V 3.1-5.5V 0.09V @ 150mA -- -- ADP121-AUJZ30R7CT-ND ADP122 300mA 3.3V 3.4-5.5V 0.085V @ 300mA -- -- ADP122AUJZ-3.3-R7CT-ND ADP1712 300mA 3.3V 3.5-5.5V 0.17V @ 300mA -- -- ADP1712AUJZ-3.3-R7TR-ND AP7311 (Low Cost) 150mA 3.3V 3.5-6V 0.15V @ 150mA -- -- AP7311-33WG-7DICT-ND LD39015M18R 150mA 1.8V 1.9V-5.5V 0.08V @ 100mA -- -- 497-6977-1-ND LP2985A-33DBVR 150mA 3.3V 3.3-16V 0.28V @ 150mA 206 150 296-18479-1-ND MCP1824T-3302E/OT 300mA 3.3V 3.5V-6V 0.2V @ 300mA -- -- MCP1824T-3302E/OTCT-ND MIC5205-2.5YM5 TR 150mA 2.5V 2.7-16V 0.165V @ 150mA -- -- 576-1257-2-ND MIC5205-3.0YM5 TR 150mA 3.0V 3.2V-16V 0.165V @ 150mA -- -- 576-1258-2-ND MIC5205-3.3YM5 TR 150mA 3.3V 3.5V-16V 0.165V @ 150mA -- -- 576-1259-2-ND TPS780330220 150mA 3.3V+2.2V 3.6-5.5V 250mV Max -- -- 296-23332-1-ND TDA3663/N1,135 100mA 3.3V 3.5-45V 0.18V @ 50mA -- -- 568-5343-1-ND Max operating temp can be calculated using θJA, TJ (max junction temperature), and power in watts. Set the "Maximum Ambient Temperature" until it reaches TJ ("Max Junction Temperature"), which is the absolute limit for safe use of the regulator: Heat Sink Temperature Calculator <http://www.daycounter.com/Calculators/Heat-Sink-Temperature-Calculator.phtml> For example, With 12V source into a 3.3V LP2985 and a 30mA load, we are dissipating (12V-3.3V) * 0.03A = 0.261W. With a θJA of 206 °C/W, a TJ of 150°C, and 261mW we can safely use the chip without a heat sink up to 75°C (=147.1°C Junction Temperature).
U2 = Intel:5M80ZE64C5N; BUILT_BY: EMA_Cory; COPYRIGHT: Copyright (C) 2018 Accelerated Designs. All rights reserved; DATASHEET: https://www.intel.com/content/dam/www/programmable/us/en/pdfs/literature/hb/max-v/max5_handbook.pdf; MANUFACTURER_PART_NUMBER: 5M80ZE64C5N; SOURCELIBRARY: Intel_2020-02-04; VENDOR: Intel
U3 = SN74HCT245PWR:SN74HCT245PWR; DATASHEET_URL: http://www.ti.com/lit/gpn/SN74HCT245; DESCRIPTION: Octal Bus Transceivers With 3-State Outputs; FAMILY_NAME: STANDARD TRANSCEIVER; GENERIC_PART_NUMBER: SN74HCT245; INDUSTRY_STD_PKG_TYPE: TSSOP; MANUFACTURER: Texas Instruments; MANUFACTURER_PART_NUMBER: SN74HCT245PWR; PACKAGE_DESIGNATOR: PW; PIN_COUNT: 20; VENDOR: Texas Instruments

## Net classes
0 default: clearance 0.205 mm

## Board
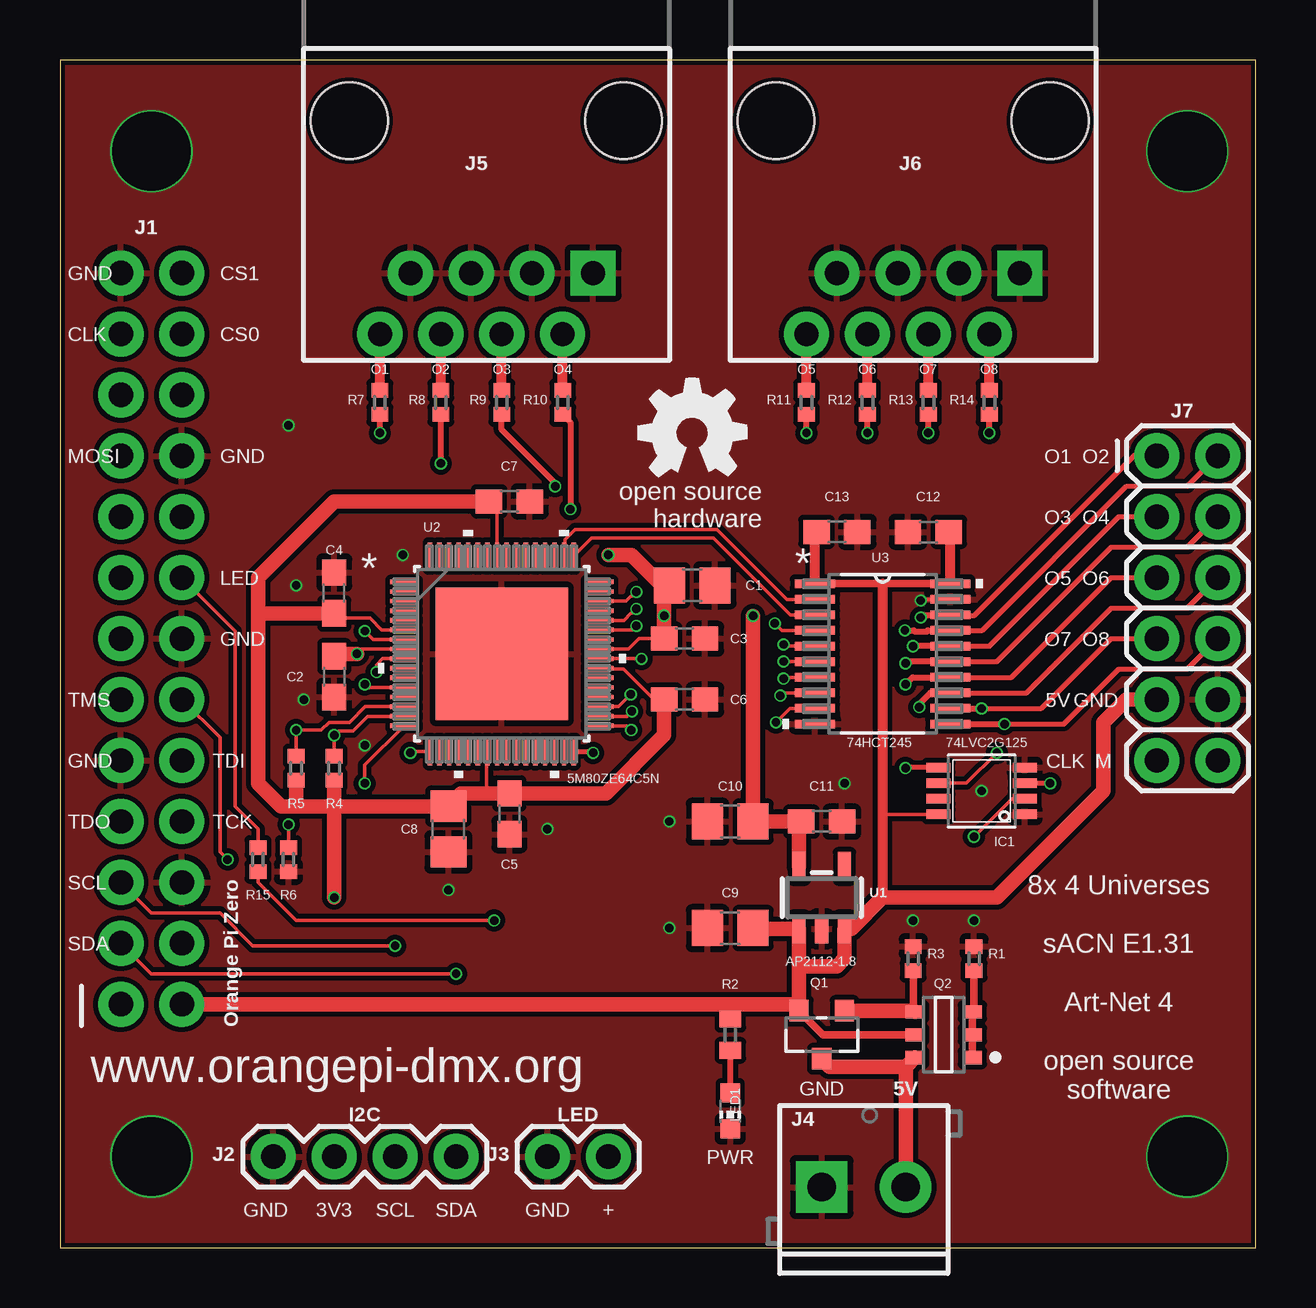
[diagram p1: board, top side]
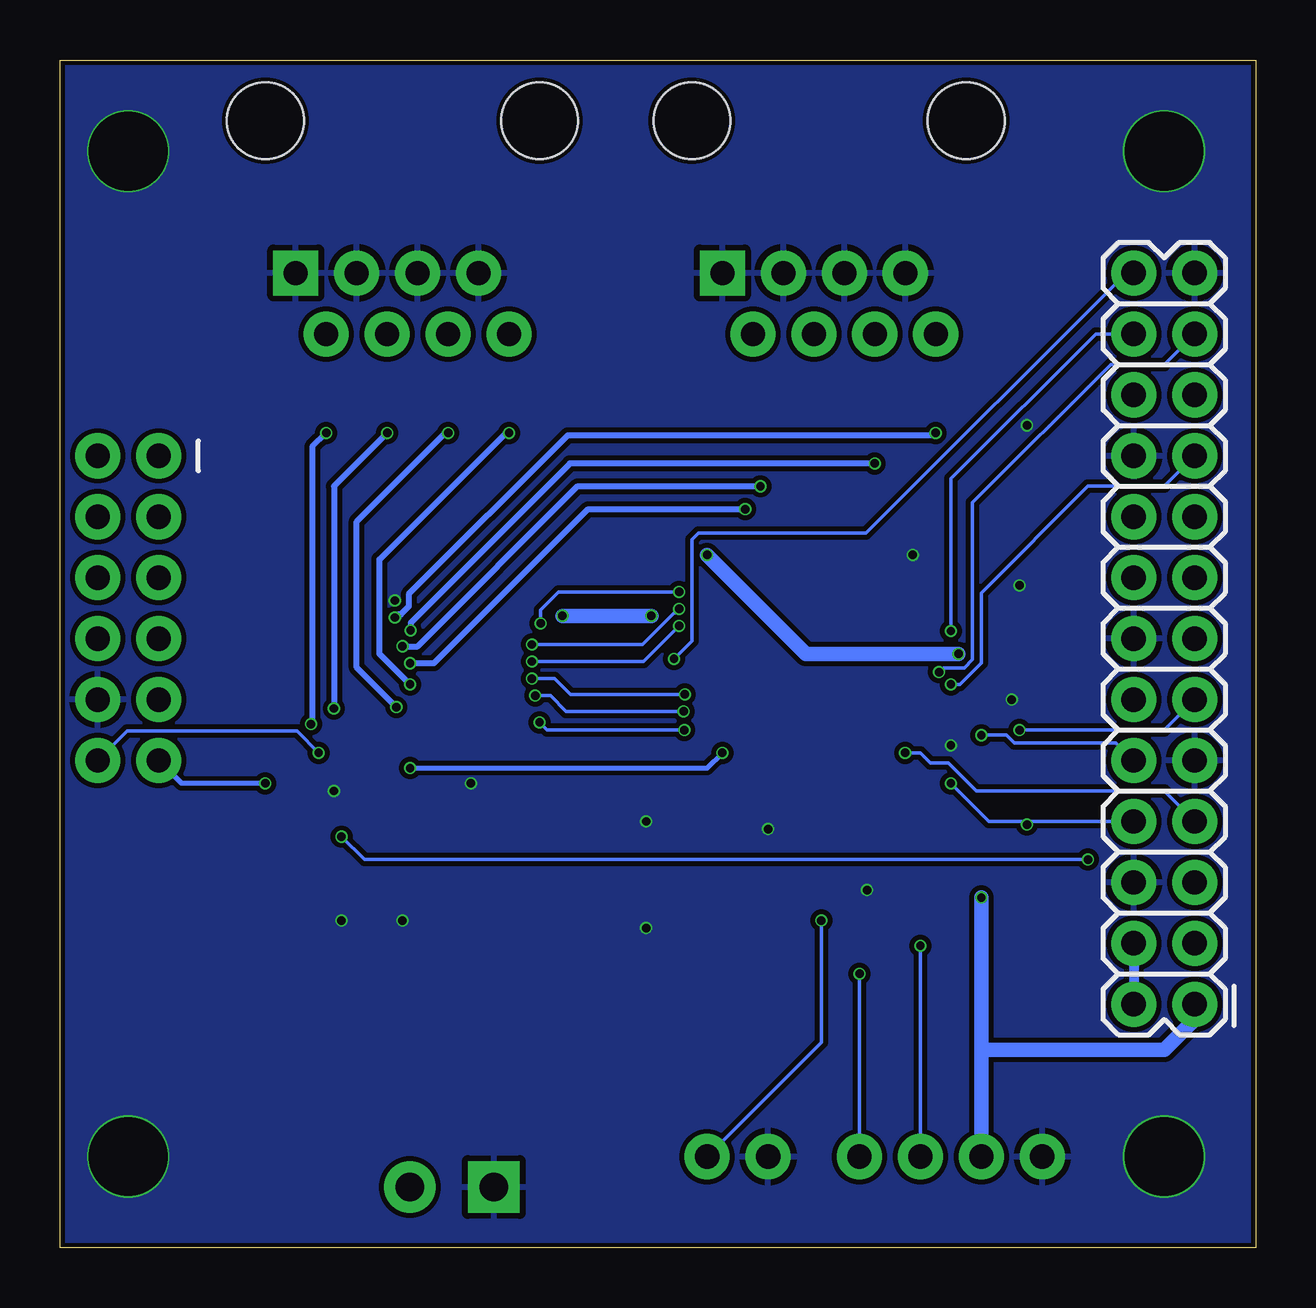
[diagram p2: board, bottom side, seen from below]

Size 49.83 x 49.52 mm. Coordinates in mm from the lower left corner, seen from the top.
Outline: 0,0 49.83,0 49.83,49.52 0,49.52 0,0
Copper layers (1*16): Top 0.035mm / dielectric 1.6mm / Bottom 0.035mm
Design rules "jlcpcb-2layers": minimum track width 5mil, minimum drill 0.3mm, track to track 5mil, track to pad 5mil, pad to pad 5mil, via to via 5mil, smd to smd 5mil, copper to edge 0.2mm, drill to drill 6mil, minimum pad ring 10mil, minimum via ring 3mil, stop-mask expansion 4mil, vias tented up to drill 0mil, thermal gap 10mil

### Footprints (pad centres in the part's own frame; a part is rotated, then mirrored left to right if it is on the bottom)
C0805 = smd 1.3 x 1.5: 1 -0.95,0; 2 0.95,0
C0603 = smd 1.1 x 1: 1 -0.85,0; 2 0.85,0
SSOP08 = smd 0.4 x 1: 1 -0.975,-1.8; 2 -0.325,-1.8; 3 0.325,-1.8; 4 0.975,-1.8; 5 0.975,1.8; 6 0.325,1.8; 7 -0.325,1.8; 8 -0.975,1.8
2X13 = drill 1.016 pad 1.88: 1 0,0; 2 0,2.54; 3 2.54,0; 4 2.54,2.54; 5 5.08,0; 6 5.08,2.54; 7 7.62,0; 8 7.62,2.54; 9 10.16,0; 10 10.16,2.54; 11 12.7,0; 12 12.7,2.54; 13 15.24,0; 14 15.24,2.54; 15 17.78,0; 16 17.78,2.54; 17 20.32,0; 18 20.32,2.54; 19 22.86,0; 20 22.86,2.54; 21 25.4,0; 22 25.4,2.54; 23 27.94,0; 24 27.94,2.54; 25 30.48,0; 26 30.48,2.54
1X04 = drill 1.016 pad 1.88: 1 0,0; 2 2.54,0; 3 5.08,0; 4 7.62,0
1X02 = drill 1.016 pad 1.88: 1 0,0; 2 2.54,0
SCREWTERMINAL-3.5MM-2 = drill 1.2 pad 2.032 square: 1 0,0 | drill 1.2 pad 2.032: 2 3.5,0
RJ45-8 = drill 1 pad 1.88 square: 1 -4.445,6.35 | drill 1 pad 1.88: 2 -3.175,8.89; 3 -1.905,6.35; 4 -0.635,8.89; 5 0.635,6.35; 6 1.905,8.89; 7 3.175,6.35; 8 4.445,8.89 | hole 3.2: -5.715,0; 5.715,0
2X6 = drill 1.016 pad 1.88: 1 0,0; 2 0,2.54; 3 2.54,0; 4 2.54,2.54; 5 5.08,0; 6 5.08,2.54; 7 7.62,0; 8 7.62,2.54; 9 10.16,0; 10 10.16,2.54; 11 12.7,0; 12 12.7,2.54
CHIP-LED0603 = smd 0.8 x 0.8: A 0,-0.75; C 0,0.75
DIODES_INC._DMG2305UX-13_0 = smd 0.9 x 0.8: 1 -1,0.95; 2 -1,-0.95; 3 1,0
DIODES_DMMT5401-7-F_0 = smd 0.8 x 0.55: 1 -1.2,0.95; 2 -1.2,0; 3 -1.2,-0.95; 4 1.2,-0.95; 5 1.2,0; 6 1.2,0.95
R0402 = smd 0.6 x 0.7: 1 -0.5,0; 2 0.5,0
R0402' = smd 0.7 x 0.9: 1 -0.65,0; 2 0.65,0
SOT23-5 = smd 0.55 x 1.2: 1 -0.95,-1.3; 2 0,-1.3; 3 0.95,-1.3; 4 0.95,1.3; 5 -0.95,1.3
EQFP64P_A1P2-D4P5_INT-L = smd 1.143 x 0.178: 1 -4.077,3; 2 -4.077,2.6; 3 -4.077,2.2; 4 -4.077,1.8; 5 -4.077,1.4; 6 -4.077,1; 7 -4.077,0.6; 8 -4.077,0.2; 9 -4.077,-0.2; 10 -4.077,-0.6; 11 -4.077,-1; 12 -4.077,-1.4; 13 -4.077,-1.8; 14 -4.077,-2.2; 15 -4.077,-2.6; 16 -4.077,-3; 33 4.077,-3; 34 4.077,-2.6; 35 4.077,-2.2; 36 4.077,-1.8; 37 4.077,-1.4; 38 4.077,-1; 39 4.077,-0.6; 40 4.077,-0.2; 41 4.077,0.2; 42 4.077,0.6; 43 4.077,1; 44 4.077,1.4; 45 4.077,1.8; 46 4.077,2.2; 47 4.077,2.6; 48 4.077,3 | smd 0.178 x 1.143: 17 -3,-4.077; 18 -2.6,-4.077; 19 -2.2,-4.077; 20 -1.8,-4.077; 21 -1.4,-4.077; 22 -1,-4.077; 23 -0.6,-4.077; 24 -0.2,-4.077; 25 0.2,-4.077; 26 0.6,-4.077; 27 1,-4.077; 28 1.4,-4.077; 29 1.8,-4.077; 30 2.2,-4.077; 31 2.6,-4.077; 32 3,-4.077; 49 3,4.077; 50 2.6,4.077; 51 2.2,4.077; 52 1.8,4.077; 53 1.4,4.077; 54 1,4.077; 55 0.6,4.077; 56 0.2,4.077; 57 -0.2,4.077; 58 -0.6,4.077; 59 -1,4.077; 60 -1.4,4.077; 61 -1.8,4.077; 62 -2.2,4.077; 63 -2.6,4.077; 64 -3,4.077 | smd 5.512 x 5.512: EPAD 0,0
PW20 = smd 1.676 x 0.356: 1 -2.819,2.925; 2 -2.819,2.275; 3 -2.819,1.625; 4 -2.819,0.975; 5 -2.819,0.325; 6 -2.819,-0.325; 7 -2.819,-0.975; 8 -2.819,-1.625; 9 -2.819,-2.275; 10 -2.819,-2.925; 11 2.819,-2.925; 12 2.819,-2.275; 13 2.819,-1.625; 14 2.819,-0.975; 15 2.819,-0.325; 16 2.819,0.325; 17 2.819,0.975; 18 2.819,1.625; 19 2.819,2.275; 20 2.819,2.925

### Placement (x,y rotation side)
C1  26.35,27.62 0 top
C2  11.43,23.81 270 top
C3  26.04,25.4 0 top
C4  11.43,27.3 90 top
C5  18.73,18.1 270 top
C6  26.04,22.86 0 top
C7  18.73,31.11 0 top
C8  16.19,17.46 270 top
C9  27.94,13.33 180 top
C10  27.94,17.78 180 top
C11  31.75,17.78 0 top
C12  36.2,29.85 180 top
C13  32.38,29.85 0 top
GOLD_ORB_SM1  26.35,33.97 0 top
IC1  38.42,19.05 90 top
J1  2.54,10.16 90 bottom
J2  8.89,3.81 0 top
J3  20.32,3.81 0 top
J4  31.75,2.54 0 top
J5  17.78,46.99 180 top
J6  35.56,46.99 180 top
J7  45.72,33.02 270 top
LED1  27.94,5.71 180 top
Q1  31.75,8.89 270 top
Q2  36.83,8.89 180 top
R1  38.1,12.07 270 top
R2  1K  [R0402']  27.94,8.89 270 top
R3  35.56,12.07 270 top
R4  11.43,20 270 top
R5  9.84,20 270 top
R6  9.53,16.19 90 top
R7  13.34,35.24 90 top
R8  15.88,35.24 90 top
R9  18.41,35.24 90 top
R10  20.96,35.24 90 top
R11  31.11,35.24 90 top
R12  33.65,35.24 90 top
R13  36.2,35.24 90 top
R14  38.73,35.24 90 top
R15  8.26,16.19 90 top
U1  31.75,14.61 0 top
U2  18.41,24.76 0 top
U3  34.29,24.76 0 top

### Tracks (layer width: path | path; a pad name or v marks a point on that pad's centre or on a via)
/SPI_CS0  (via drill 0.35)
  Top 0.152: U2.7 13.05,25.36 v12.7,25.72
  Bottom 0.152: v12.7,25.72 12.7,32.07 6.67,38.1 J1.24
/SPI_CS1  (via drill 0.35)
  Top 0.152: U2.40 v24.23,24.57 v24.24,24.56
  Bottom 0.152: v24.24,24.56 23.5,25.3 23.5,29.53 23.23,29.8 16.24,29.8 5.4,40.64 J1.26
A1
  Top 0.152: U2.50 21.05,28.87 21.05,29.53 21.46,29.95 27.39,29.95 30.3,27.04 U3.2
A2
  Top 0.152: U2.49 22.16,29.59 27.24,29.59 30.44,26.39 U3.3
A3  (via drill 0.35)
  Top 0.152: v24.03,27.35 23.85,27.17 23.81,27.17 23.6,26.96 U2.46 | U3.4 30.09,25.74 v29.8,26.04
  Bottom 0.152: v29.8,26.04 29.8,26.6 29.04,27.35 v24.03,27.35
A4  (via drill 0.35)
  Top 0.152: v24.03,26.64 23.85,26.46 23.81,26.46 23.51,26.17 U2.44 | U3.5 30.23,25.09 v30.16,25.15
  Bottom 0.152: v24.03,26.64 24.2,26.46 24.25,26.46 24.56,26.15 25.55,25.15 v30.16,25.15
A5  (via drill 0.35)
  Top 0.152: U3.6 v30.16,24.45 | v24.03,25.93 23.86,25.76 U2.43
  Bottom 0.152: v30.16,24.45 25.51,24.45 v24.03,25.93
A6  (via drill 0.35)
  Top 0.152: v23.79,23.07 23.28,22.57 U2.35 | U3.7 30.22,23.79 v30.16,23.73
  Bottom 0.152: v30.16,23.73 29.21,23.73 28.55,23.07 v23.79,23.07
A7  (via drill 0.35)
  Top 0.152: v23.84,22.37 23.64,22.17 U2.34 | U3.8 30.14,23.14 v30.02,23.02
  Bottom 0.152: v23.84,22.37 28.73,22.37 29.39,23.02 v30.02,23.02
A8  (via drill 0.35)
  Top 0.152: v23.81,21.59 23.64,21.76 U2.33 | U3.9 30.43,22.49 v29.84,21.91
  Bottom 0.152: v29.84,21.91 29.53,21.59 v23.81,21.59
B1  (via drill 0.35)
  Top 0.152: J7.1 45.68,33.06 | 37.15,26.35 U3.18
  Top 0.203: 45.68,33.06 44.81,33.06 38.1,26.35 37.15,26.35
  Top 0.254: v13.34,33.97 R7.1 | v35.88,26.28 35.99,26.39 U3.18
  Bottom 0.152: 13.44,33.87 v13.34,33.97
  Bottom 0.254: 13.44,33.87 28.68,33.87 35.29,27.25 35.29,26.75 35.64,26.4 35.75,26.4 v35.88,26.28
B2  (via drill 0.35)
  Top 0.203: J7.2 46.99,31.75 44.45,31.75 38.44,25.74 U3.17
  Top 0.254: v15.88,32.7 R8.1 | v35.22,25.74 35.59,25.74 35.64,25.7 36.12,25.7 36.16,25.74 U3.17
  Bottom 0.254: v15.88,32.7 28.57,32.7 35.22,26.06 v35.22,25.74
B3  (via drill 0.35)
  Top 0.152: v20.64,31.75 20.64,31.89 | v35.57,25.09 v35.56,25.08
  Top 0.203: U3.16 38.74,25.09 44.13,30.48 J7.3
  Top 0.254: 20.64,31.89 18.41,34.11 R9.1 | U3.16 v35.57,25.09
  Bottom 0.254: v35.56,25.08 34.92,25.08 28.26,31.75 v20.64,31.75
B4  (via drill 0.35)
  Top 0.152: 35.31,24.44 v35.24,24.37
  Top 0.203: J7.4 46.99,29.21 43.81,29.21 39.04,24.44 U3.15
  Top 0.254: v21.27,30.8 21.27,34.42 R10.1 | U3.15 35.31,24.44
  Bottom 0.254: v35.24,24.37 34.24,24.37 27.82,30.8 v21.27,30.8
B5  (via drill 0.35)
  Top 0.203: J7.5 43.81,27.94 39.66,23.79 37.15,23.79 U3.14
  Top 0.254: v35.24,23.5 35.54,23.79 37.15,23.79 | v31.11,33.97 R11.1
  Bottom 0.254: v35.24,23.5 36.51,24.76 36.51,28.7 31.24,33.97 v31.11,33.97
B6  (via drill 0.35)
  Top 0.203: J7.6 46.99,26.67 43.81,26.67 40.28,23.14 U3.13
  Top 0.254: v35.81,22.54 35.81,22.68 36.27,23.14 U3.13 | v33.65,33.97 R12.1
  Bottom 0.254: v35.81,22.54 37.46,24.19 37.46,30.29 33.78,33.97 v33.65,33.97
B7  (via drill 0.35)
  Top 0.203: J7.7 43.81,25.4 40.9,22.49 v38.42,22.49
  Top 0.254: U3.12 v38.42,22.49 | v36.2,33.97 R13.1
  Bottom 0.254: v38.42,22.49 38.42,31.75 v36.2,33.97
B8  (via drill 0.35)
  Top 0.203: J7.8 46.99,24.13 44.13,24.13 41.84,21.84 v39.37,21.84
  Top 0.254: v38.73,33.97 R14.1 | U3.11 v39.37,21.84
  Bottom 0.254: v38.73,33.97 v38.75,33.97 39.32,33.4 39.32,21.89 v39.37,21.84
CLK  (via drill 0.35)
  Top 0.152: 35.26,20.03 v35.24,20
  Top 0.203: U2.32 22.17,20.69 | IC1.5 35.26,20.03
  Top 0.254: 22.17,20.69 v22.23,20.64
  Bottom 0.203: v35.24,20 22.86,20 v22.23,20.64
GND  (via drill 0.35, 3.28)
  Top 0.152: v35.88,26.99 35.93,27.04 U3.19
  other vias: 3.81,45.72 46.99,45.72 3.81,3.81 46.99,3.81 10.16,22.86 38.42,19.05 12.7,20.96 14.29,28.89 9.84,27.62 9.53,34.29 32.7,19.37 25.4,17.78 25.4,13.33 38.1,13.65 35.56,13.65 16.19,14.92 20.32,17.46
  pour Top: 0,49.53 0,0 50.16,0 50.16,49.53
  pour Bottom: 0,49.53 0,0 50.16,0 50.16,49.53
GPIO7  (via drill 0.35)
  Top 0.152: J1.12 6.67,21.27 6.67,16.51 v6.99,16.19 | v38.1,17.14 39.68,18.72 IC1.2
  Bottom 0.152: v6.99,16.19 37.15,16.19 v38.1,17.14
I2C_SCL  (via drill 0.35)
  Top 0.152: v13.97,12.6 8.04,12.6 6.67,13.97 3.81,13.97 J1.5
  Bottom 0.152: J2.3 v13.97,12.6
I2C_SDA  (via drill 0.35)
  Top 0.152: v16.51,11.43 3.81,11.43 J1.3
  Bottom 0.152: v16.51,11.43 J2.4
LED
  Top 0.152: R15.2 8.26,17.46 7.3,18.42 7.3,25.72 J1.16
MOSFET  (via drill 0.35)
  Top 0.152: IC1.6 37.79,19.37 v39.05,20.64
  Bottom 0.152: v39.05,20.64 39.96,21.54 47.04,21.54 J7.12
N$1
  Top 0.305: R1.2 38.1,9.91 Q2.3 Q2.2 Q2.1
N$2
  Top 0.61: J4.2 35.25,7.56 | 35.25,7.56 Q2.6 | Q1.3 32.08,7.56 35.25,7.56
N$3
  Top 0.305: R3.2 35.58,11.54 35.58,9.89
  Top 0.61: Q1.1 35.58,9.89 Q2.4
N$4  (via drill 0.35)
  Top 0.152: R15.1 8.26,15.24 9.84,13.65 v18.1,13.65
  Bottom 0.152: v18.1,13.65 18.1,8.57 J3.2
N$9  (via drill 0.35)
  Top 0.152: 41.27,19.37 v41.27,19.37
  Top 0.203: IC1.3 41.27,19.37
  Bottom 0.203: v41.27,19.37 44.77,19.37 J7.11
N$14
  Top 0.254: LED1.A R2.2
O1
  Top 0.406: R7.2 J5.8
O2
  Top 0.406: R8.2 J5.6
O3
  Top 0.406: R9.2 J5.4
O4
  Top 0.406: R10.2 J5.2
O5
  Top 0.406: R11.2 J6.8
O6
  Top 0.406: R12.2 J6.6
O7
  Top 0.406: R13.2 J6.4
O8
  Top 0.406: R14.2 J6.2
SPI_CLK  (via drill 0.35)
  Top 0.152: U2.9 13.45,24.57 13.19,24.3 v13.19,24
  Bottom 0.152: v13.19,24 13.02,24.18 12.14,24.18 11.8,24.52 11.8,31.07 6.03,36.83 3.81,36.83 J1.23
SPI_MOSI  (via drill 0.35)
  Top 0.152: U2.12 12.83,23.36 v12.7,23.5
  Bottom 0.152: v12.7,23.5 12.32,23.5 11.44,24.37 11.44,27.3 6.99,31.75 3.81,31.75 J1.19
TCK  (via drill 0.35)
  Top 0.152: v9.53,17.65 R6.2 | U2.16 12.7,20.13 v12.7,19.37
  Bottom 0.152: v12.7,19.37 11.11,17.78 9.4,17.78 | v9.53,17.65 9.46,17.72 9.4,17.78 | J1.8 9.4,17.78
TDI  (via drill 0.35)
  Top 0.152: R4.1 v11.43,21.37 11.61,21.55 12.21,21.55 12.83,22.17 U2.15
  Bottom 0.152: v11.43,21.37 10.38,21.37 10.06,21.06 5.82,21.06 J1.10
TDO  (via drill 0.35)
  Top 0.152: v14.61,20.64 14.66,20.69 U2.17
  Bottom 0.152: v14.61,20.64 13.97,20.64 13.55,20.22 12.8,20.22 11.63,19.05 3.81,19.05 J1.7
TMS  (via drill 0.35)
  Top 0.152: R5.1 v9.84,21.59 10.89,21.59 11.21,21.91 12.07,21.91 12.72,22.57 U2.14
  Bottom 0.152: v9.84,21.59 3.81,21.59 J1.11
VCC
  Top 0.152: C9.1 | IC1.8 34.31,18.07 34.29,18.1
  Top 0.254: 34.29,27.69
  Top 0.305: Q2.5 31.8,8.89 Q1.2 | U3.20 34.29,27.69 U3.1
  Top 0.406: U3.20 37.11,29.78 C12.1 | C13.1 31.47,29.78 U3.1 | 34.29,27.69 34.29,18.1 34.29,14.61
  Top 0.61: 30.8,11.75 U1.1 28.92,13.3 C9.1 | 30.8,11.75 Q1.2 30.53,10.16 27.94,10.16 | 30.8,11.75 32.38,11.75 32.7,12.06 U1.3 32.99,13.3 34.29,14.61 39.05,14.61 43.5,19.05 43.5,21.91 44.45,22.86 J7.9 | J1.2 27.94,10.16 | R2.1 27.94,10.16
  Bottom 0.406: J1.4 J1.2
VCCINT  (via drill 0.35)
  Top 0.152: 30.8,17.68 C11.1 | U2.41 23.7,24.96 24.13,25.4 C3.1 | U2.8 12.58,24.96 v12.38,24.76
  Top 0.61: C3.1 v25.18,26.35 25.18,27.4 C1.1 25.09,27.62 23.82,28.89 v22.86,28.89 | v12.38,24.76 11.53,24.76 C2.1 | U1.5 30.8,17.68 | C11.1 C10.1 v28.89,26.35
  Bottom 0.61: v28.89,26.35 v25.18,26.35 | v22.86,28.89 18.73,24.76 v12.38,24.76
VCCIO  (via drill 0.35)
  Top 0.152: U2.57 18.21,30.78 C7.1 | U2.6 13.41,25.76 12.92,26.25 11.63,26.25 | U2.39 22.52,24.14 23.48,24.14 24.76,22.86 C6.1 | U2.23 17.79,20.66 17.79,20 17.78,20 17.78,18.95
  Top 0.61: C6.1 25.18,21.37 22.76,18.95 C5.1 17.78,18.95 16.73,18.95 C8.1 11.43,18.41 | 11.63,26.25 C4.1 8.36,26.46 8.26,26.35 | 11.43,18.41 9.84,18.41 | 9.84,18.41 9.21,18.41 8.26,19.37 8.26,26.35 | R4.2 11.43,18.41 | R5.2 9.84,18.41 | C7.1 11.43,31.11 8.26,27.94 8.26,26.35 | 11.43,18.41 v11.43,14.61
  Bottom 0.61: v11.43,14.61 11.43,8.25 | 11.43,8.25 J2.2 | 11.43,8.25 3.81,8.25 2.54,9.53 J1.1

### Text on the board
tPlace: GND | CS1 | CLK | CS0 | O1 | O2 | O3 | O4 | O5 | O6 | O7 | O8 | MOSI | GND | O1 | O2 | O3 | O4 | LED | O5 | O6 | GND | O7 | O8 | TMS | 5V | GND | GND | TDI | CLK | M | TDO | TCK | SCL | 8x 4 Universes / / sACN E1.31 / / Art-Net 4 / / open source / software | SDA | www.orangepi-dmx.org | GND | GND | 3V3 | SCL | SDA | GND | +